# Altium schematic sheet MCU.SchDoc
size Letter
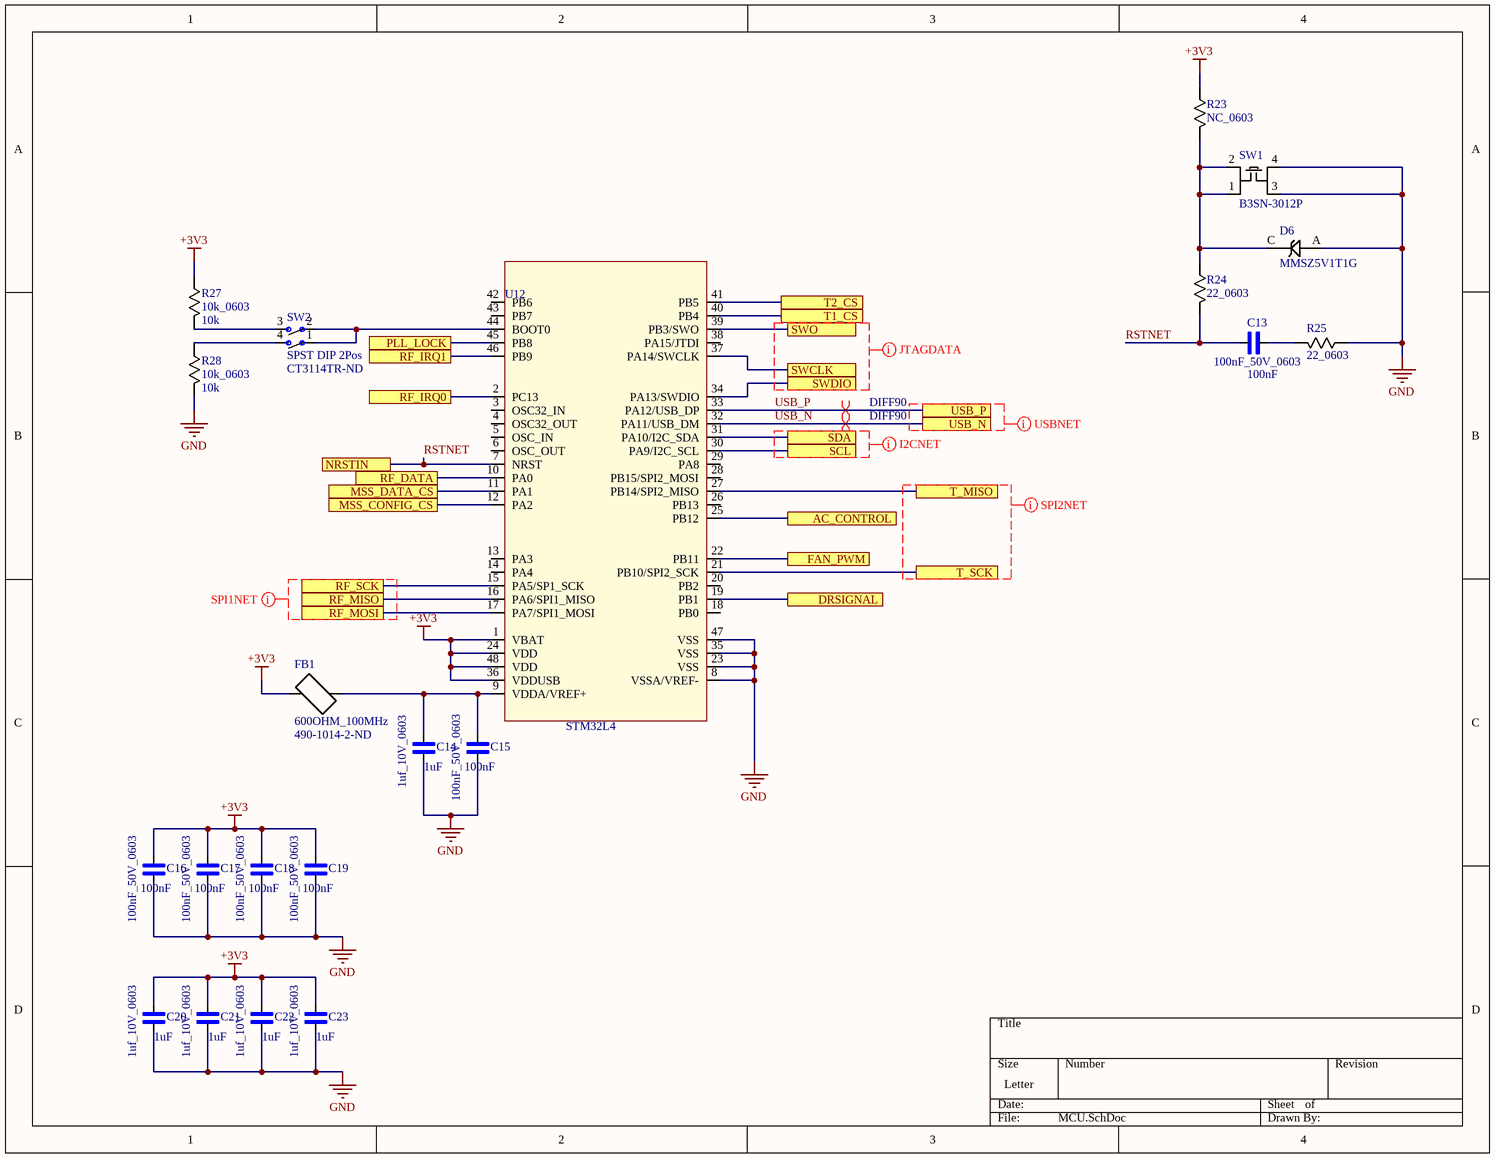
[diagram p0: MCU.SchDoc]

## Parts
C13  100nF_50V_0603  Capacitance: 100nF  [0603]
C14  1uf_10V_0603  Capacitance: 1uF  [0603]
C15  100nF_50V_0603  Capacitance: 100nF  [0603]
C16  100nF_50V_0603  Capacitance: 100nF  [0603]
C17  100nF_50V_0603  Capacitance: 100nF  [0603]
C18  100nF_50V_0603  Capacitance: 100nF  [0603]
C19  100nF_50V_0603  Capacitance: 100nF  [0603]
C20  1uf_10V_0603  Capacitance: 1uF  [0603]
C21  1uf_10V_0603  Capacitance: 1uF  [0603]
C22  1uf_10V_0603  Capacitance: 1uF  [0603]
C23  1uf_10V_0603  Capacitance: 1uF  [0603]
D6  MMSZ5V1T1G  [SOIC127P370X94-2N]
FB1  600OHM_100MHz  Supplier Part Number 1: 490-1014-2-ND  [0603]
R23  NC_0603  [0603]
R24  22_0603  [0603]
R25  22_0603  [0603]
R27  10k_0603  Resistance: 10k  [0603]
R28  10k_0603  Resistance: 10k  [0603]
SW1  B3SN-3012P  [B3SN-3012P]
SW2  SPST DIP 2Pos  Supplier Part Number 1: CT3114TR-ND  [SOP254P990X385-4N]
U12  STM32L4  [TSQFP50P900X900X160-48N]

## Ports
AC_CONTROL, DRSIGNAL, FAN_PWM, MSS_CONFIG_CS, MSS_DATA_CS, NRSTIN, PLL_LOCK, RF_DATA, RF_IRQ0, RF_IRQ1, RF_MISO, RF_MOSI, RF_SCK, SCL, SDA, SWCLK, SWDIO, SWO, T1_CS, T2_CS, T_MISO, T_SCK, USB_N, USB_P

## Nets
+3V3: C16.2 C17.2 C18.2 C19.2 C20.2 C21.2 C22.2 C23.2 FB1.1 R23.2 R27.2 U12.1(VBAT) U12.24(VDD) U12.36(VDDUSB) U12.48(VDD)
GND: C14.1 C15.1 C16.1 C17.1 C18.1 C19.1 C20.1 C21.1 C22.1 C23.1 D6.A R25.2 R28.1 SW1.3 SW1.4 U12.8(VSSA/VREF-) U12.23(VSS) U12.35(VSS) U12.47(VSS)
AC_CONTROL: U12.25(PB12) ; port AC_CONTROL
DRSIGNAL: U12.19(PB1) ; port DRSIGNAL
FAN_PWM: U12.22(PB11) ; port FAN_PWM
MSS_CONFIG_CS: U12.12(PA2) ; port MSS_CONFIG_CS
MSS_DATA_CS: U12.11(PA1) ; port MSS_DATA_CS
PLL_LOCK: U12.45(PB8) ; port PLL_LOCK
RF_DATA: U12.10(PA0) ; port RF_DATA
RF_IRQ0: U12.2(PC13) ; port RF_IRQ0
RF_IRQ1: U12.46(PB9) ; port RF_IRQ1
RF_MISO: U12.16(PA6/SPI1_MISO) ; port RF_MISO
RF_MOSI: U12.17(PA7/SPI1_MOSI) ; port RF_MOSI
RF_SCK: U12.15(PA5/SP1_SCK) ; port RF_SCK
RSTNET: C13.1 R24.1 U12.7(NRST) ; port NRSTIN
SCL: U12.30(PA9/I2C_SCL) ; port SCL
SDA: U12.31(PA10/I2C_SDA) ; port SDA
SWCLK: U12.37(PA14/SWCLK) ; port SWCLK
SWDIO: U12.34(PA13/SWDIO) ; port SWDIO
SWO: U12.39(PB3/SWO) ; port SWO
T1_CS: U12.40(PB4) ; port T1_CS
T2_CS: U12.41(PB5) ; port T2_CS
T_MISO: U12.27(PB14/SPI2_MISO) ; port T_MISO
T_SCK: U12.21(PB10/SPI2_SCK) ; port T_SCK
USB_N: U12.32(PA11/USB_DM) ; port USB_N
USB_P: U12.33(PA12/USB_DP) ; port USB_P
NetC13_2: C13.2 R25.1
NetC14_2: C14.2 C15.2 FB1.2 U12.9(VDDA/VREF+)
NetD6_C: D6.C R23.1 R24.2 SW1.1 SW1.2
NetR27_1: R27.1 SW2.3
NetR28_2: R28.2 SW2.4
NetSW2_1: SW2.1 SW2.2 U12.44(BOOT0)

Not connected (* = marked no-connect by the designer): U12 3(OSC32_IN) 4(OSC32_OUT) 5(OSC_IN) 6(OSC_OUT) 13(PA3) 14(PA4) 18(PB0) 20(PB2) 26(PB13) 28(PB15/SPI2_MOSI) 29(PA8) 38(PA15/JTDI) 42(PB6) 43(PB7)

## Layout directives
differential pair; differential pair class DIFF90: USB_N, USB_P
net class USBCLASS: (no net found under the mark)
net class I2CCLASS; rule Matched Net Lengths [Tolerance = 10mil]: (no net found under the mark)
net class SPI2DATACLASS; rule Matched Net Lengths [Tolerance = 10mil]: (no net found under the mark)
net class SPI1DATA; rule Matched Net Lengths [Tolerance = 10mil]: (no net found under the mark)
net class JTAGDATA; rule Matched Net Lengths [Tolerance = 10mil]: (no net found under the mark)

## Library data of the parts
C13 C15-C19 = 100nF_50V_0603: Manufacturer: Murata; Manufacturer Part Number: GRM188R71H104KA93D; Material: Ceramic; Tolerance: 10%; Voltage Rating: 50V; Dielectric: X7R; Insulation Resistance: 10GR; Supplier 1: Digi-Key; Stock 1: 0; Pricing 1: 1=0.12, 10=0.084, 100=0.0396, 500=0.02778, 1000=0.023 (USD); Mount: Surface Mount; Case/Package: 0603; Number of Pins: 2; Case Code (Imperial): 0603; Case Code (Metric): 1608; Dielectric Material: Ceramic; Contact Plating: Tin,Matte; Min Operating Temperature: -55°C; Max Operating Temperature: 125°C; Packaging: Tape and Reel; Voltage Rating (DC): 50V; Package Quantity: 1; Termination: SMD/SMT; Voltage: 50V; Length: 1.6mm; Height: 0.8mm; Width: 0.8mm; Thickness: 0.035inch; Depth: 0.8mm; Radiation Hardening: No; REACH SVHC: No SVHC; Lead Free: Lead Free; ComponentLink1URL: https://datasheet.ciiva.com/19467/1857604-19467681.pdf; ComponentLink1Description: https://datasheet.ciiva.com/19467/1857604-19467681.pdf; ComponentLink2URL: https://datasheet.ciiva.com/28534/4360-28534245.pdf; ComponentLink2Description: https://datasheet.ciiva.com/28534/4360-28534245.pdf; ComponentLink3URL: https://datasheet.ciiva.com/26915/getdatasheetpartid-89095-26915384.pdf; ComponentLink3Description: https://datasheet.ciiva.com/26915/getdatasheetpartid-89095-26915384.pdf; ComponentLink4URL: https://datasheet.ciiva.com/131/partnumbering-e-01-131738.pdf; ComponentLink4Description: https://datasheet.ciiva.com/131/partnumbering-e-01-131738.pdf; ComponentLink5URL: https://datasheet.ciiva.com/7937/1747470-7937658.pdf; ComponentLink5Description: https://datasheet.ciiva.com/7937/1747470-7937658.pdf; ComponentLink6URL: https://datasheet.ciiva.com/14116/nmgrm-data-en-14116602.pdf; ComponentLink6Description: https://datasheet.ciiva.com/14116/nmgrm-data-en-14116602.pdf; ComponentLink7URL: https://datasheet.ciiva.com/131/partnumbering-e-01-131739.pdf; ComponentLink7Description: https://datasheet.ciiva.com/131/partnumbering-e-01-131739.pdf; ComponentLink8URL: https://datasheet.ciiva.com/7937/4360-7937659.pdf; ComponentLink8Description: https://datasheet.ciiva.com/7937/4360-7937659.pdf; ComponentLink9URL: https://datasheet.ciiva.com/48436/nmgrm-data-en-48436667.pdf; ComponentLink9Description: https://datasheet.ciiva.com/48436/nmgrm-data-en-48436667.pdf; ComponentLink10URL: https://datasheet.ciiva.com/131/partnumbering-e-01-131740.pdf; ComponentLink10Description: https://datasheet.ciiva.com/131/partnumbering-e-01-131740.pdf; ComponentLink11URL: https://datasheet.ciiva.com/11786/0900766b807a1cab-11786047.pdf; ComponentLink11Description: https://datasheet.ciiva.com/11786/0900766b807a1cab-11786047.pdf; ComponentLink12URL: https://datasheet.ciiva.com/29201/451744-da-01-en-vs-kondensator-0603-29201904.pdf; ComponentLink12Description: https://datasheet.ciiva.com/29201/451744-da-01-en-vs-kondensator-0603-29201904.pdf; Supplier Part Number 1: 490-1519-6-ND
C14 C20-C23 = 1uf_10V_0603: Manufacturer: Murata; Manufacturer Part Number: GRM188R61A105KA61J; Voltage Rating: 10V; Tolerance: 10%; Dielectric: X5R; Supplier 1: Digi-Key; Stock 1: 0; Pricing 1: 30000=0.0118 (USD); Mount: Surface Mount; Case/Package: 0603; Case Code (Metric): 1608; Case Code (Imperial): 0603; Min Operating Temperature: -55°C; Max Operating Temperature: 85°C; Package Quantity: 1; Packaging: Tape and Reel; Voltage Rating (DC): 10V; Termination: SMD/SMT; Length: 1.6mm; Height: 0.8mm; Width: 0.031inch; Thickness: 0.035inch; Depth: 0.8mm; Radiation Hardening: No; REACH SVHC: No SVHC; ComponentLink1URL: https://datasheet.ciiva.com/6270/product-6270752.pdf; ComponentLink1Description: https://datasheet.ciiva.com/6270/product-6270752.pdf; ComponentLink2URL: https://datasheet.ciiva.com/6270/partnumbering-e-01-6270748.pdf; ComponentLink2Description: https://datasheet.ciiva.com/6270/partnumbering-e-01-6270748.pdf; ComponentLink3URL: https://datasheet.ciiva.com/6270/partnumbering-e-01-6270750.pdf; ComponentLink3Description: https://datasheet.ciiva.com/6270/partnumbering-e-01-6270750.pdf; Supplier Part Number 1: GRM188R61A105KA61J-ND
D6 = MMSZ5V1T1G: DIODE Zener 5.1V 500mw; Manufacturer: ON Semiconductor; Material: Plastic; Tolerance: 5%; Impedance: 60R; Max Reverse Leakage Current: 2uA; Test Current: 5mA; Element Configuration: Single; Forward Voltage: 900mV; Zener Current: 10mA; Breakdown Voltage: 5.36V; Supplier 1: Future Electronics; Manufacturer Part Number: MMSZ5V1T1G; Stock 1: 0; Case/Package: SOD-123-2; Number of Pins: 2; Min Operating Temperature: -55°C; Max Operating Temperature: 150°C; Package Quantity: 1; Max Power Dissipation: 500mW; Packaging: Tape and Reel; Zener Voltage: 5.1V; Power Dissipation: 500mW; Voltage Tolerance: 5%; Working Voltage: 5.1V; Peak Reverse Current: 2uA; Voltage Rating (DC): 5.1V; Power Rating: 500mW; Length: 2.69mm; Height: 1.12mm; Width: 1.6mm; Radiation Hardening: No; Lead Free: Lead Free; REACH SVHC: No SVHC; ComponentLink1URL: https://datasheet.ciiva.com/895/mmsz2v4t1-d-895025.pdf; ComponentLink1Description: https://datasheet.ciiva.com/895/mmsz2v4t1-d-895025.pdf; ComponentLink2URL: https://datasheet.ciiva.com/895/mmsz2v4t1-d-895026.pdf; ComponentLink2Description: https://datasheet.ciiva.com/895/mmsz2v4t1-d-895026.pdf; ComponentLink3URL: https://datasheet.ciiva.com/895/mmsz2v4t1-d-895027.pdf; ComponentLink3Description: https://datasheet.ciiva.com/895/mmsz2v4t1-d-895027.pdf; ComponentLink4URL: https://datasheet.ciiva.com/15142/getdatasheetpartid-72078-15142387.pdf; ComponentLink4Description: https://datasheet.ciiva.com/15142/getdatasheetpartid-72078-15142387.pdf; ComponentLink5URL: https://datasheet.ciiva.com/8346/mmsz2v4t1-d-8346086.pdf; ComponentLink5Description: https://datasheet.ciiva.com/8346/mmsz2v4t1-d-8346086.pdf; ComponentLink6URL: https://datasheet.ciiva.com/8026/78656-8026888.pdf; ComponentLink6Description: https://datasheet.ciiva.com/8026/78656-8026888.pdf; ComponentLink7URL: https://datasheet.ciiva.com/26092/mmsz2v4t1-d-26092696.pdf; ComponentLink7Description: https://datasheet.ciiva.com/26092/mmsz2v4t1-d-26092696.pdf; ComponentLink8URL: https://datasheet.ciiva.com/16542/mmsz2v4t1-d-16542073.pdf; ComponentLink8Description: https://datasheet.ciiva.com/16542/mmsz2v4t1-d-16542073.pdf; ComponentLink9URL: https://datasheet.ciiva.com/8026/78656-8026890.pdf; ComponentLink9Description: https://datasheet.ciiva.com/8026/78656-8026890.pdf; Supplier Part Number 1: MMSZ5V1T1G
FB1 = 600OHM_100MHz: Manufacturer: Murata; Manufacturer Part Number: BLM18AG601SN1D; Core Material: Ferrite; Material: Steel,Ferrite; Tolerance: 25%; Impedance: 600R; Max Current Rating: 500mA; Number of Lines: 1; DC Resistance (DCR): 380mR; Test Frequency: 100MHz; Shielding: Unshielded; Supplier 1: Digi-Key; Stock 1: 432000; Pricing 1: 4000=0.02096, 8000=0.019, 12000=0.01834, 28000=0.01703, 100000=0.01683 (USD); Case/Package: 0603; Number of Pins: 2; Weight: 7.1E-05oz; Case Code (Metric): 1608; Case Code (Imperial): 0603; Min Operating Temperature: -55°C; Max Operating Temperature: 125°C; Package Quantity: 1; Packaging: Tape and Reel; Current Rating: 500mA; Termination: SMD/SMT; Max DC Current: 500mA; DC Current: 500mA; Military Standard: Not; Frequency: 100MHz; Number of Circuits: 1; Length: 1.6mm; Height: 0.8mm; Width: 0.8mm; Depth: 0.8mm; Radiation Hardening: No; REACH SVHC: No SVHC; Lead Free: Lead Free; ComponentLink1URL: https://datasheet.ciiva.com/1012/l0110s0100blm18a-1012017.pdf; ComponentLink1Description: https://datasheet.ciiva.com/1012/l0110s0100blm18a-1012017.pdf; ComponentLink2URL: https://datasheet.ciiva.com/1012/l0110s0100blm18a-1012018.pdf; ComponentLink2Description: https://datasheet.ciiva.com/1012/l0110s0100blm18a-1012018.pdf; ComponentLink3URL: https://datasheet.ciiva.com/1012/l0110s0100blm18a-1012019.pdf; ComponentLink3Description: https://datasheet.ciiva.com/1012/l0110s0100blm18a-1012019.pdf; ComponentLink4URL: https://datasheet.ciiva.com/1466/1756147-1466933.pdf; ComponentLink4Description: https://datasheet.ciiva.com/1466/1756147-1466933.pdf; ComponentLink5URL: https://datasheet.ciiva.com/19460/1844766-19460213.pdf; ComponentLink5Description: https://datasheet.ciiva.com/19460/1844766-19460213.pdf; ComponentLink6URL: https://datasheet.ciiva.com/1466/1756147-1466934.pdf; ComponentLink6Description: https://datasheet.ciiva.com/1466/1756147-1466934.pdf; ComponentLink7URL: https://datasheet.ciiva.com/16210/l0110s0100blm18a-16210006.pdf; ComponentLink7Description: https://datasheet.ciiva.com/16210/l0110s0100blm18a-16210006.pdf; ComponentLink8URL: https://datasheet.ciiva.com/3081/l0110s0100blm18a-3081613.pdf; ComponentLink8Description: https://datasheet.ciiva.com/3081/l0110s0100blm18a-3081613.pdf; ComponentLink9URL: https://datasheet.ciiva.com/29347/442309-da-01-en-chip-drossel-0603-600r-500ma-1-6x0-8mm-29347900.pdf; ComponentLink9Description: https://datasheet.ciiva.com/29347/442309-da-01-en-chip-drossel-0603-600r-500ma-1-6x0-8mm-29347900.pdf; ComponentLink10URL: https://datasheet.ciiva.com/41449/001172228-da-01-en-drossel-0603-600r-1-6x0-8mm-4000st-41449517.pdf; ComponentLink10Description: https://datasheet.ciiva.com/41449/001172228-da-01-en-drossel-0603-600r-1-6x0-8mm-4000st-41449517.pdf
R23 = NC_0603: Resistance: NC
R24 R25 = 22_0603: Manufacturer: Vishay; Manufacturer Part Number: CRCW060322R0FKEA; Tolerance: 1%; Resistance: 22R; Voltage Rating: 75V; Temperature Coefficient: 100ppm/°C; Power Rating: 100mW; Supplier 1: Digi-Key; Stock 1: 0; Pricing 1: 5000=0.00497, 10000=0.00432, 25000=0.00405 (USD); Mount: Surface Mount; Case/Package: 0603; Weight: 7.1E-05oz; Case Code (Imperial): 0603; Case Code (Metric): 1608; Contact Plating: Tin,Lead; Min Operating Temperature: -55°C; Max Operating Temperature: 155°C; Packaging: Tape and Reel; Termination: SMD/SMT; Package Quantity: 5000; Military Standard: Not; Composition: Thick Film; Voltage Rating (DC): 75V; Length: 1.55mm; Height: 0.45mm; Width: 0.85mm; Depth: 0.85mm; Radiation Hardening: No; REACH SVHC: Unknown; Lead Free: Lead Free; ComponentLink1URL: https://datasheet.ciiva.com/16382/dcrcwe3-16382261.pdf; ComponentLink1Description: https://datasheet.ciiva.com/16382/dcrcwe3-16382261.pdf; ComponentLink2URL: https://datasheet.ciiva.com/5552/dcrcwe3-109170-5552120.pdf; ComponentLink2Description: https://datasheet.ciiva.com/5552/dcrcwe3-109170-5552120.pdf; ComponentLink3URL: https://datasheet.ciiva.com/22700/1697337-22700361.pdf; ComponentLink3Description: https://datasheet.ciiva.com/22700/1697337-22700361.pdf; ComponentLink4URL: https://datasheet.ciiva.com/11809/0900766b80d98afc-11809067.pdf; ComponentLink4Description: https://datasheet.ciiva.com/11809/0900766b80d98afc-11809067.pdf; ComponentLink5URL: https://datasheet.ciiva.com/7672/1697337-7672876.pdf; ComponentLink5Description: https://datasheet.ciiva.com/7672/1697337-7672876.pdf; ComponentLink6URL: https://datasheet.ciiva.com/15159/getdatasheetpartid-33090-15159388.pdf; ComponentLink6Description: https://datasheet.ciiva.com/15159/getdatasheetpartid-33090-15159388.pdf; ComponentLink7URL: https://datasheet.ciiva.com/7672/1697337-7672877.pdf; ComponentLink7Description: https://datasheet.ciiva.com/7672/1697337-7672877.pdf; ComponentLink8URL: https://datasheet.ciiva.com/26316/fld-crcw-e3-data-en-26316590.pdf; ComponentLink8Description: https://datasheet.ciiva.com/26316/fld-crcw-e3-data-en-26316590.pdf; ComponentLink9URL: https://datasheet.ciiva.com/16893/dcrcw-16893903.pdf; ComponentLink9Description: https://datasheet.ciiva.com/16893/dcrcw-16893903.pdf; Supplier Part Number 1: 541-22.0HTR-ND
R27 R28 = 10k_0603: Manufacturer: Panasonic; Manufacturer Part Number: ERJ-3EKF1002V; Tolerance: 1%; Max Power Dissipation: 100mW; Temperature Coefficient: 100ppm/°C; Voltage Rating: 75V; Supplier 1: Digi-Key; Stock 1: 0; Pricing 1: 5000=0.00751, 10000=0.00653, 25000=0.00573, 50000=0.00526, 125000=0.00515 (USD); Mount: Surface Mount; Case/Package: 0603; Number of Pins: 2; Case Code (Metric): 1608; Case Code (Imperial): 0603; Contact Plating: Tin; Min Operating Temperature: -55°C; Max Operating Temperature: 155°C; Packaging: Tape and Reel; Power Rating: 100mW; Package Quantity: 1; Termination: SMD/SMT; Composition: Thick Film; Number of Terminations: 2; Military Standard: Not; Voltage Rating (DC): 75V; Length: 1.6mm; Height: 0.45mm; Depth: 0.8mm; Width: 0.031inch; Radiation Hardening: No; Lead Free: Lead Free; REACH SVHC: No SVHC; ComponentLink1URL: https://datasheet.ciiva.com/16511/aoa0000ce2-16511861.pdf; ComponentLink1Description: https://datasheet.ciiva.com/16511/aoa0000ce2-16511861.pdf; ComponentLink2URL: https://datasheet.ciiva.com/46372/1678782-46372725.pdf; ComponentLink2Description: https://datasheet.ciiva.com/46372/1678782-46372725.pdf; ComponentLink3URL: https://datasheet.ciiva.com/28514/426256-28514198.pdf; ComponentLink3Description: https://datasheet.ciiva.com/28514/426256-28514198.pdf; ComponentLink4URL: https://datasheet.ciiva.com/9194/aoa0000ce2-9194199.pdf; ComponentLink4Description: https://datasheet.ciiva.com/9194/aoa0000ce2-9194199.pdf; ComponentLink5URL: https://datasheet.ciiva.com/7830/aoa0000ce2-7830729.pdf; ComponentLink5Description: https://datasheet.ciiva.com/7830/aoa0000ce2-7830729.pdf; ComponentLink6URL: https://datasheet.ciiva.com/17212/aoa0000ce2-17212105.pdf; ComponentLink6Description: https://datasheet.ciiva.com/17212/aoa0000ce2-17212105.pdf; ComponentLink7URL: https://datasheet.ciiva.com/30208/aoa0000ce2-30208985.pdf; ComponentLink7Description: https://datasheet.ciiva.com/30208/aoa0000ce2-30208985.pdf; ComponentLink8URL: https://datasheet.ciiva.com/48530/aoa0000ce2-48530988.pdf; ComponentLink8Description: https://datasheet.ciiva.com/48530/aoa0000ce2-48530988.pdf; ComponentLink9URL: https://datasheet.ciiva.com/24070/aoa0000ce2-24070318.pdf; ComponentLink9Description: https://datasheet.ciiva.com/24070/aoa0000ce2-24070318.pdf; ComponentLink10URL: https://datasheet.ciiva.com/16759/70260748-16759807.pdf; ComponentLink10Description: https://datasheet.ciiva.com/16759/70260748-16759807.pdf; Supplier Part Number 1: P10.0KHTR-ND
SW1 = B3SN-3012P: Manufacturer: Omron; Mechanical Life: 100000Cycles; Contact Current Rating: 50mA; Operating Force: 1.57N; Voltage Rating (DC): 24V; Throw Configuration: SPST; Contact Resistance: 100mR; Illumination Type: Non-Illuminated,Illuminated; Number of Poles: 1; Electrical Life: 50000Cycles; Switch Travel: 0.25mm; Switch Function: Off-Mom; IP Rating: IP67,Waterproof,Dust Tight; Supplier 1: Digi-Key; Manufacturer Part Number: B3SN-3012P; Stock 1: 48000; Pricing 1: 3000=0.52365 (USD); Mount: Surface Mount; Case/Package: SMD/SMT; Weight: 0.007055oz; Contact Material: Gold; Contact Plating: Gold; Min Operating Temperature: -25°C; Max Operating Temperature: 70°C; Packaging: Tape and Reel; Max Voltage Rating (DC): 24V; Package Quantity: 1; Max Current Rating: 50mA; Current Rating: 50mA; Termination: SMD/SMT; Orientation: Straight; Length: 6.5mm; Height: 3.1mm; Depth: 7mm; Radiation Hardening: No; REACH SVHC: Unknown; Lead Free: Contains Lead; ComponentLink1URL: https://datasheet.ciiva.com/1532/en-b3sn-1532676.pdf; ComponentLink1Description: https://datasheet.ciiva.com/1532/en-b3sn-1532676.pdf; ComponentLink2URL: https://datasheet.ciiva.com/16154/en-b3sn-16154998.pdf; ComponentLink2Description: https://datasheet.ciiva.com/16154/en-b3sn-16154998.pdf; ComponentLink3URL: https://datasheet.ciiva.com/2900/b3sn-1110-2900023.pdf; ComponentLink3Description: https://datasheet.ciiva.com/2900/b3sn-1110-2900023.pdf; ComponentLink4URL: https://datasheet.ciiva.com/5283/en-b3sn-371257-5283623.pdf; ComponentLink4Description: https://datasheet.ciiva.com/5283/en-b3sn-371257-5283623.pdf; ComponentLink5URL: https://datasheet.ciiva.com/2900/b3sn-1110-2900024.pdf; ComponentLink5Description: https://datasheet.ciiva.com/2900/b3sn-1110-2900024.pdf; ComponentLink6URL: https://datasheet.ciiva.com/2900/b3sn-1110-2900025.pdf; ComponentLink6Description: https://datasheet.ciiva.com/2900/b3sn-1110-2900025.pdf; ComponentLink7URL: https://datasheet.ciiva.com/15183/getdatasheetpartid-87284-15183738.pdf; ComponentLink7Description: https://datasheet.ciiva.com/15183/getdatasheetpartid-87284-15183738.pdf; ComponentLink8URL: https://datasheet.ciiva.com/30076/en-b3sn-30076973.pdf; ComponentLink8Description: https://datasheet.ciiva.com/30076/en-b3sn-30076973.pdf; Supplier Part Number 1: SW261TR-ND
SW2 = SPST DIP 2Pos: Manufacturer: CTS; Manufacturer Part Number: 219-2MSTR; Mechanical Life: 2000Cycles; Voltage Rating (DC): 20V; Number of Positions: 2; Current Rating: 100mA; Pitch: 0.1inch; Washable: Yes; Supplier 1: Digi-Key; Stock 1: 16000; Pricing 1: 1000=0.441, 5000=0.3591 (USD); Mount: Surface Mount; Contact Material: Copper; Contact Plating: Tin,Gold; Min Operating Temperature: -55°C; Max Operating Temperature: 85°C; Throw Configuration: SPST; Packaging: Tape and Reel; Termination: Gull Wing; Electrical Life: 2000Cycles; Max Voltage Rating (DC): 20V; Max Current Rating: 100mA; Package Quantity: 1000; Orientation: Straight; Length: 0.258inch; Terminal Pitch: 2.54mm; Depth: 9.91mm; Radiation Hardening: No; Lead Free: Lead Free; ComponentLink1URL: https://datasheet.ciiva.com/15210/getdatasheetpartid-92384-15210150.pdf; ComponentLink1Description: https://datasheet.ciiva.com/15210/getdatasheetpartid-92384-15210150.pdf; ComponentLink2URL: https://datasheet.ciiva.com/8679/219-8679450.pdf; ComponentLink2Description: https://datasheet.ciiva.com/8679/219-8679450.pdf; ComponentLink3URL: https://datasheet.ciiva.com/16316/219-16316219.pdf; ComponentLink3Description: https://datasheet.ciiva.com/16316/219-16316219.pdf
U12 = STM32L433CCTx